# Altium schematic sheet P07_MICRO SD_FAN_ARM JTAG.SchDoc
size 420 x 297 mm
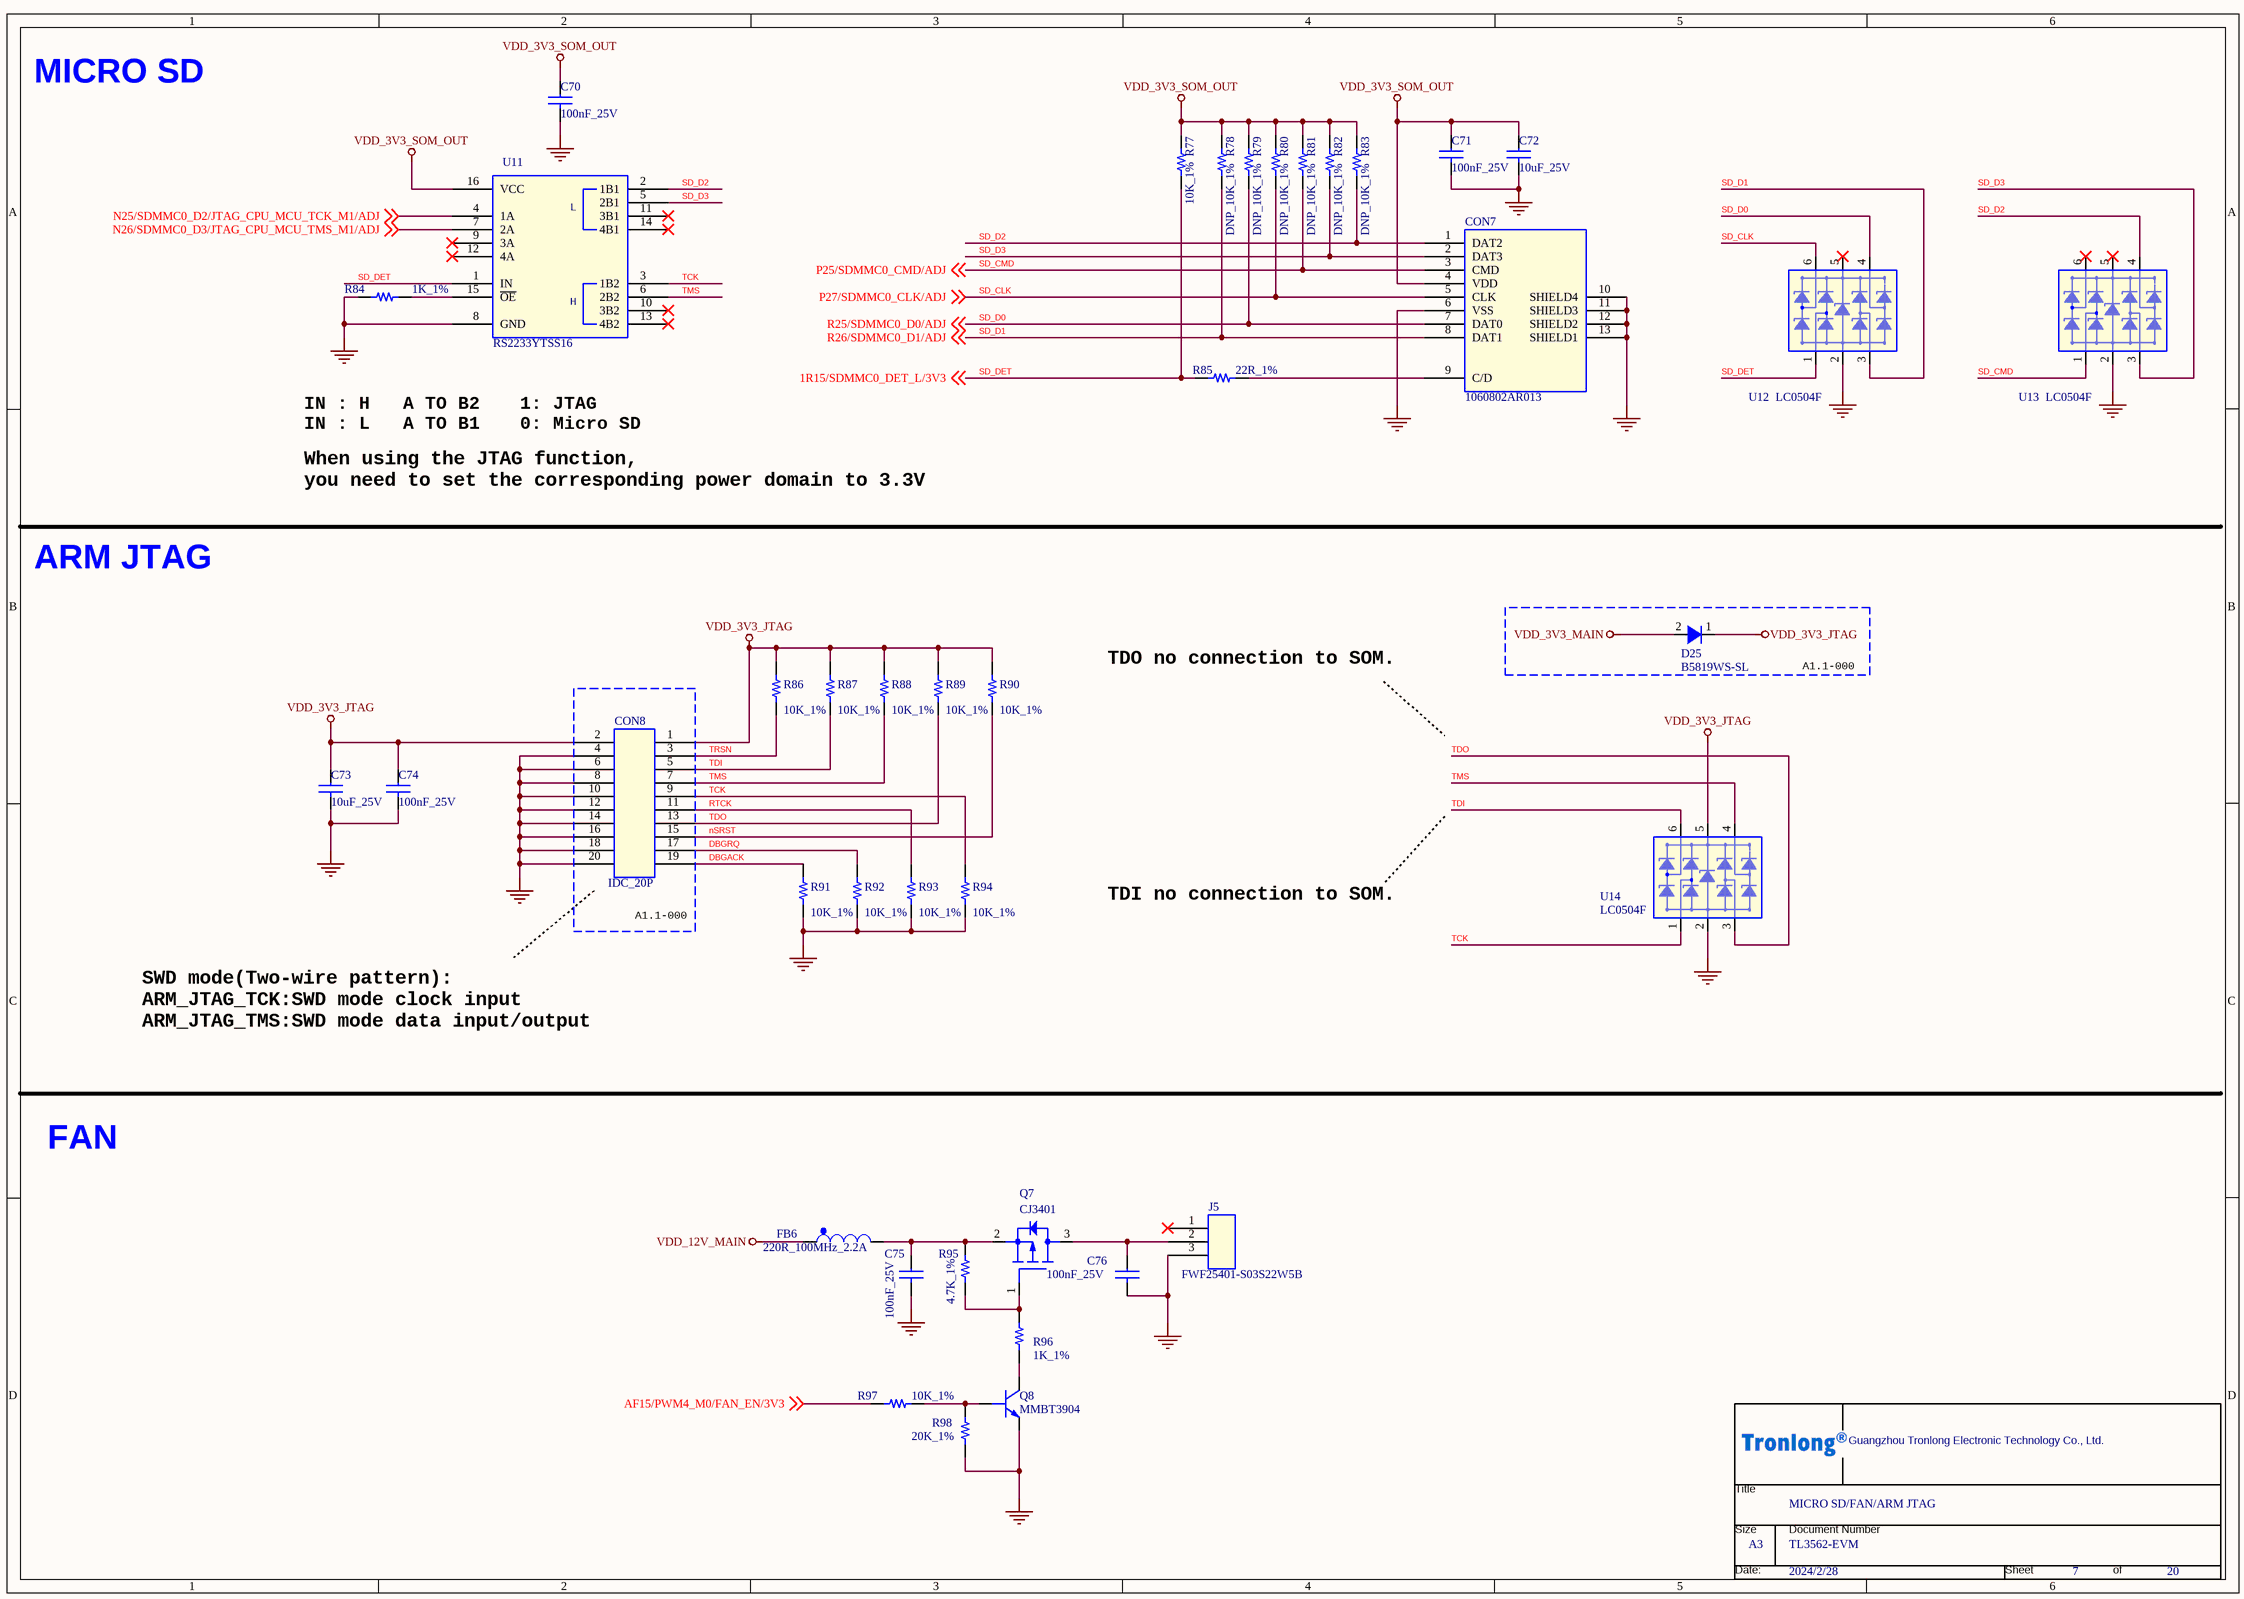
[diagram p0: P07_MICRO SD_FAN_ARM JTAG.SchDoc]

## Parts
*  Page Count: 20  Page Number: 7  Page Size: A3  OrgName: Guangzhou Tronlong Electronic Technology Co., Ltd.  Title: MICRO SD/FAN/ARM JTAG  Doc: TL3562-EVM  Page Modify Date: 2024/2/28  (hidden comment: Tronlong_TITTLE_20211115)  (graphical)
C70  100nF_25V  [C0402]
C71  100nF_25V  [C0402]
C72  10uF_25V  [C0603]
C73  10uF_25V  [C0603]
C74  100nF_25V  [C0402]
C75  100nF_25V  [C0402]
C76  100nF_25V  [C0402]
CON7  1060802AR013  [CON_TF_CARD]
CON8  IDC_20P  [con_2d54_2x10_th_box]
D25  B5819WS-SL  [SOD-323]
FB6  220R_100MHz_2.2A  [L0603]
J5  FWF25401-S03S22W5B  [mol22-23-2031]
Q7  CJ3401  [SOT23-3]
Q8  MMBT3904  [SOT23-3_DBZ3]
R77  10K_1%  [R0402]
R78  DNP_10K_1%  [R0402]
R79  DNP_10K_1%  [R0402]
R80  DNP_10K_1%  [R0402]
R81  DNP_10K_1%  [R0402]
R82  DNP_10K_1%  [R0402]
R83  DNP_10K_1%  [R0402]
R84  1K_1%  [R0402]
R85  22R_1%  [R0402]
R86  10K_1%  [R0402]
R87  10K_1%  [R0402]
R88  10K_1%  [R0402]
R89  10K_1%  [R0402]
R90  10K_1%  [R0402]
R91  10K_1%  [R0402]
R92  10K_1%  [R0402]
R93  10K_1%  [R0402]
R94  10K_1%  [R0402]
R95  4.7K_1%  [R0402]
R96  1K_1%  [R0402]
R97  10K_1%  [R0402]
R98  20K_1%  [R0402]
U11  RS2233YTSS16  [TSSOP16]
U12  LC0504F  [SOT363]
U13  LC0504F  [SOT363]
U14  LC0504F  [SOT363]

## Blocks framed on the sheet
A1.1-000: D25
A1.1-000: CON8

## Nets
GND: C70.2 C71.2 C72.2 C73.2 C74.2 C75.2 C76.2 CON7.6(VSS) CON7.10(SHIELD4) CON7.11(SHIELD3) CON7.12(SHIELD2) CON7.13(SHIELD1) CON8.4 CON8.6 CON8.8 CON8.10 CON8.12 CON8.14 CON8.16 CON8.18 CON8.20 J5.3 Q8.2(E) R84.2 R91.2 R92.2 R93.2 R94.2 R98.2 U11.8(GND) U12.2 U13.2 U14.2
VDD_3V3_JTAG: C73.1 C74.1 CON8.1 CON8.2 D25.1(Anode) R86.1 R87.1 R88.1 R89.1 R90.1 U14.5
VDD_3V3_MAIN: D25.2(Cathode)
VDD_3V3_SOM_OUT: C70.1 C71.1 C72.1 CON7.4(VDD) R77.1 R78.1 R79.1 R80.1 R81.1 R82.1 R83.1 U11.16(VCC)
VDD_12V_MAIN: FB6.1
AF15/PWM4_M0/FAN_EN/3V3: R97.1 ; off-sheet AF15/PWM4_M0/FAN_EN/3V3
DBGACK: CON8.19 R91.1
DBGRQ: CON8.17 R92.1
N25/SDMMC0_D2/JTAG_CPU_MCU_TCK_M1/ADJ: U11.4(1A) ; off-sheet N25/SDMMC0_D2/JTAG_CPU_MCU_TCK_M1/ADJ
N26/SDMMC0_D3/JTAG_CPU_MCU_TMS_M1/ADJ: U11.7(2A) ; off-sheet N26/SDMMC0_D3/JTAG_CPU_MCU_TMS_M1/ADJ
nSRST: CON8.15 R90.2
RTCK: CON8.11 R93.1
SD_CLK: CON7.5(CLK) R80.2 U12.6 ; off-sheet P27/SDMMC0_CLK/ADJ  [also labelled P27/SDMMC0_CLK/ADJ]
SD_CMD: CON7.3(CMD) R81.2 U13.1 ; off-sheet P25/SDMMC0_CMD/ADJ  [also labelled P25/SDMMC0_CMD/ADJ]
SD_D0: CON7.7(DAT0) R79.2 U12.4 ; off-sheet R25/SDMMC0_D0/ADJ  [also labelled R25/SDMMC0_D0/ADJ]
SD_D1: CON7.8(DAT1) R78.2 U12.3 ; off-sheet R26/SDMMC0_D1/ADJ  [also labelled R26/SDMMC0_D1/ADJ]
SD_D2: CON7.1(DAT2) R83.2 U11.2(1B1) U13.4
SD_D3: CON7.2(DAT3) R82.2 U11.5(2B1) U13.3
SD_DET: R77.2 R85.1 U11.1(IN) U12.1 ; off-sheet 1R15/SDMMC0_DET_L/3V3  [also labelled 1R15/SDMMC0_DET_L/3V3]
TCK: CON8.9 R94.1 U11.3(1B2) U14.1
TDI: CON8.5 R87.2 U14.6
TDO: CON8.13 R89.2 U14.3
TMS: CON8.7 R88.2 U11.6(2B2) U14.4
TRSN: CON8.3 R86.2
NetC75_1: C75.1 FB6.2 Q7.2(SOURCE) R95.1
NetC76_1: C76.1 J5.2 Q7.3(DRAIN)
NetCON7_9: CON7.9(C/D) R85.2
NetQ7_1: Q7.1(GATE) R95.2 R96.1
NetQ8_1: Q8.1(B) R97.2 R98.1
NetQ8_3: Q8.3(C) R96.2
NetR84_1: R84.1 U11.15(~{OE})

Not connected (* = marked no-connect by the designer): J5 1*; U11 9(3A)* 10(3B2)* 11(3B1)* 12(4A)* 13(4B2)* 14(4B1)*; U12 5*; U13 5* 6*

## Notes on the sheet
- MICRO SD
- IN : H   A TO B2
  IN : L   A TO B1
- 1: JTAG
  0: Micro SD
- When using the JTAG function,
  you need to set the corresponding power domain to 3.3V
- ARM JTAG
- TDO no connection to SOM.
- TDI no connection to SOM.
- SWD mode(Two-wire pattern):
  ARM_JTAG_TCK:SWD mode clock input
  ARM_JTAG_TMS:SWD mode data input/output
- FAN
- (in symbol Tronlong_TITTLE_20211115) Title; Size; Document Number; Date:; Sheet; of
- (in symbol TS3A5018DR_2) L; H

## Library data of the parts
* = Tronlong_TITTLE_20211115: RevCode: A?; Page Create Date: March  8, 1995
C70 C71 C74-C76 = CAP NP_Dup3: 贴片陶瓷电容,100nF,10%,25V,X5R; Manufacturer Character: 中国大陆; Operation Temperature（℃）: -55~85℃; As-Welded: /; PCB Footprint: C0402
  C70: Temperature: -55~155℃
  C71 C74: Temperature: -55~125℃
C72 C73 = CAP NP_Dup3: 贴片陶瓷电容,10uF,10%,10V,X5R; Manufacturer Character: 中国大陆; As-Welded: /; Operation Temperature（℃）: -55~85℃; PCB Footprint: C0603; Temperature: -55~125℃
CON7 = PROCONN SDC009-52-D_3: Micro SD卡座,9PIN,90度,贴片，GE- T-FLASH PUSH TYPE外焊式外壳带弹片1.80H(3U); Manufacturer: 广州高炬电子科技有限公司(TORCH); Manufacturer Character: 中国大陆; As-Welded: /; Operation Temperature（℃）: -40~85℃; Manufacturer PartNumber: 1060802AR013; Temperature: -40~85℃; PCB Footprint: CON_TF_CARD
CON8 = CON20A: 简易牛角座,2X10PIN,间距2.54MM,180度,公座,黑色,插件; Manufacturer Character: 中国大陆; Manufacturer PartNumber: FBH25401-D20S1004K6K; Manufacturer: 深圳特思嘉工业电子有限公司（TXGA）; PCB Footprint: con_2d54_2x10_th_box_90; Operation Temperature（℃）: -40~+105(Ta); As-Welded: /
D25 = Diode200mA250V_2: 肖特基二极管,VR=40V,IF=1A,VF=0.6V@1A; TIIntPartnumber: 1E0013; MfrNum: MMSD103T1G; Mfr: On Semiconductor; Manufacturer Character: 中国大陆; Manufacturer: 江苏长晶科技股份有限公司（JSCJ）; DescriptiveText: Diode 200mA 250V 1.25V Forward Drop; PCB Footprint: smd123; Cost10K: 0.07; Cost100: 0.23; Vendor: Digikey; As-Welded: /; Operation Temperature（℃）: -55~125℃; PartName: Diode200mA250V; Descriptive_Text: Diode 200mA 250V 1.25V Forward Drop; Temperature: -40~125℃; Manufacturer PartNumber: B5819WS-SL
FB6 = FB_0: 磁珠,50mΩ,2.2A,220R@100MHz; Manufacturer Character: 中国大陆; Manufacturer PartNumber: UPZ1608U221-2R2TF; Manufacturer: 深圳顺络电子股份有限公司（Sunlord）; Operation Temperature（℃）: -55~125℃; As-Welded: /; Temperature: -55~125℃; PCB Footprint: L0603
J5 = CON3: 端子座,3PIN,间距2.54MM,180度,2510连接器,白色,插件; Manufacturer Character: 中国大陆; Manufacturer: 深圳特思嘉工业电子有限公司（TXGA）; As-Welded: /; Manufacturer PartNumber: FWF25401-S03S22W5B; Temperature: -25~85℃; PCB Footprint: mol22-23-2031
Q7 = MOSFET P SOT: MOSFET,P沟道,VDSS=-30V,VGSS=±12V,ID=-4.2A,PD=0.35W,VGS(th)=-1.3V; Manufacturer Character: 中国大陆; Manufacturer: 江苏长晶科技有限公司（JSCJ）; As-Welded: /; Operation Temperature（℃）: -55~150℃; room: DCIN; Temperature: -55~150℃; Manufacturer PartNumber: CJ3401; Manufacturer Part Number: CJ3401; PCB Footprint: SOT23-3
Q8 = MMBT3904/SOT: BJT,NPN,Vceo=40V,Ic=200mA,fT=300MHz,PD=200mW; Manufacturer Character: 中国大陆; Manufacturer: 江苏长晶科技有限公司（JSCJ）; As-Welded: /; Operation Temperature（℃）: -55~150℃; Manufacturer PartNumber: MMBT3904; Temperature: -55~150℃; PCB Footprint: SOT23-3_DBZ3
R77 = Resistor_Dup3: 贴片电阻,10K,±1%,1/16W; Manufacturer Character: 中国大陆; CLASS: DISCRETE; As-Welded: /; room: 485-5; Operation Temperature（℃）: -55~155℃; PCB Footprint: R0402; Temperature: -55~155℃
R78-R83 = Resistor_Dup3: 贴片电阻,10K,±1%,1/16W; Manufacturer Character: 中国大陆; CLASS: DISCRETE; As-Welded: DNP; Operation Temperature（℃）: -55~155℃; PCB Footprint: R0402; Temperature: –55~155℃
R84 = Resistor_Dup3: 贴片电阻,1K,±1%,1/16W; Manufacturer Character: 中国大陆; CLASS: DISCRETE; room: JTAG_DSP; Operation Temperature（℃）: -55~155℃; As-Welded: /; PCB Footprint: R0402
R85 = Resistor_Dup3: 贴片电阻,22R,±1%,1/16W; Manufacturer Character: 中国大陆; CLASS: DISCRETE; As-Welded: /; Operation Temperature（℃）: -55~155℃; PCB Footprint: R0402; Temperature: -55~155℃
R86-R94 = Resistor_Dup3: 贴片电阻,10K,±1%,1/16W; Manufacturer Character: 中国大陆; CLASS: DISCRETE; room: 485-5; Operation Temperature（℃）: -55~155℃; As-Welded: /; Temperature: -55~155℃; PCB Footprint: R0402
R95 = Resistor_Dup3: 贴片电阻,4.7K,±1%,1/16W; Manufacturer Character: 中国大陆; Mistral Part No: 110009031036-R; Mfr_name: PANASONIC-ECG; Mfr_part_number: ERJ-2RNF6981V; Part_type: RESISTORS\FIXED; CLASS: DISCRETE; Operation Temperature（℃）: -55~155℃; As-Welded: /; Project: TELEMETRY ENCODER; Customs_HS_Code: 85332119; Custom_Duty: 15%; PCB Footprint: R0402; Tolerance: 1%; Wattage: 1/16W; Package: 0402; Distributor_name: NA; Distributor_part_number: NA; Height: 0.40MM; Datasheet: Y:\MIS_DATABASE\DATASHEETS\RESISTORS\PAN_ERJ.PDF; Crtd /date: MAZHAR/090807; Chkd/date: SHREESHAIL/100807
R96 = Resistor_Dup3: 贴片电阻,1K,±1%,1/16W; Part_type: RESISTORS\FIXED; Mfr_part_number: ERJ-2RNF6981V; Mfr_name: PANASONIC-ECG; Mistral Part No: 110009031036-R; Manufacturer Character: 中国大陆; CLASS: DISCRETE; Custom_Duty: 15%; Customs_HS_Code: 85332119; Project: TELEMETRY ENCODER; As-Welded: /; Operation Temperature（℃）: -55~155℃; PCB Footprint: R0402; Chkd/date: SHREESHAIL/100807; Crtd /date: MAZHAR/090807; Datasheet: Y:\MIS_DATABASE\DATASHEETS\RESISTORS\PAN_ERJ.PDF; Height: 0.40MM; Distributor_part_number: NA; Distributor_name: NA; Package: 0402; Wattage: 1/16W; Tolerance: 1%
R97 = Resistor_Dup3: 贴片电阻,10K,±1%,1/16W; Mistral Part No: 110009031036-R; Mfr_name: PANASONIC-ECG; Mfr_part_number: ERJ-2RNF6981V; Part_type: RESISTORS\FIXED; Manufacturer Character: 中国大陆; CLASS: DISCRETE; Project: TELEMETRY ENCODER; Customs_HS_Code: 85332119; Custom_Duty: 15%; As-Welded: /; Operation Temperature（℃）: -55~155℃; PCB Footprint: R0402; Tolerance: 1%; Wattage: 1/16W; Package: 0402; Distributor_name: NA; Distributor_part_number: NA; Height: 0.40MM; Datasheet: Y:\MIS_DATABASE\DATASHEETS\RESISTORS\PAN_ERJ.PDF; Crtd /date: MAZHAR/090807; Chkd/date: SHREESHAIL/100807
R98 = Resistor_Dup3: 贴片电阻,20K,±1%,1/16W; Manufacturer Character: 中国大陆; Part_type: RESISTORS\FIXED; Mfr_part_number: ERJ-2RNF6981V; Mfr_name: PANASONIC-ECG; Mistral Part No: 110009031036-R; CLASS: DISCRETE; Operation Temperature（℃）: -55~155℃; As-Welded: /; Custom_Duty: 15%; Customs_HS_Code: 85332119; Project: TELEMETRY ENCODER; Chkd/date: SHREESHAIL/100807; Crtd /date: MAZHAR/090807; Datasheet: Y:\MIS_DATABASE\DATASHEETS\RESISTORS\PAN_ERJ.PDF; Height: 0.40MM; Distributor_part_number: NA; Distributor_name: NA; Package: 0402; Wattage: 1/16W; Tolerance: 1%; PCB Footprint: R0402
U11 = TS3A5018DR_2: 4路模拟开关芯片; Manufacturer: 江苏润石科技有限公司（RUNIC）; Manufacturer Character: 中国大陆; Operation Temperature（℃）: -40~85℃; room: JTAG_DSP; As-Welded: /; Temperature: -40~85℃; Manufacturer PartNumber: RS2233YTSS16; PCB Footprint: TSSOP16
U12 = PRTR5V0U4Y_0: ESD二极管,VRWM=5V,VBR=6V,四组,单向,8KV,15KV; Manufacturer: 上海雷卯电子科技有限公司（Leiditech）; Manufacturer Character: 中国大陆; As-Welded: /; Operation Temperature（℃）: -55~125℃; room: SD; Temperature: -40~85℃; Manufacturer PartNumber: LC0504F; Manufacturer Part Number: PRTR5V0U4Y; PCB Footprint: SOT363
U13 = PRTR5V0U4Y_0: ESD二极管,VRWM=5V,VBR=6V,四组,单向,8KV,15KV; Manufacturer Character: 中国大陆; Manufacturer: 上海雷卯电子科技有限公司（Leiditech）; As-Welded: /; Operation Temperature（℃）: -55~125℃; room: SD; Temperature: -40~85℃; Manufacturer PartNumber: LC0504F; Manufacturer Part Number: PRTR5V0U4Y; PCB Footprint: SOT363
U14 = PRTR5V0U4Y_0: ESD二极管,VRWM=5V,VBR=6V,四组,单向,8KV,15KV; Manufacturer Character: 中国大陆; Manufacturer: 上海雷卯电子科技有限公司（Leiditech）; room: SD; Operation Temperature（℃）: -55~125℃; As-Welded: /; PCB Footprint: SOT363; Temperature: -40~85℃; Manufacturer PartNumber: LC0504F; Manufacturer Part Number: PRTR5V0U4Y